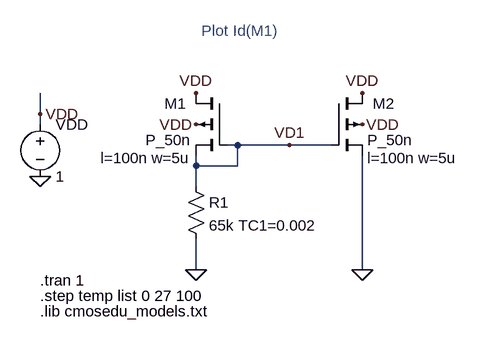
[diagram p0: schematic Fig20_26.asc]
Fig20_26.asc, the LTspice schematic file:
Version 4
SHEET 1 1136 680
WIRE 288 -16 288 -48
WIRE 288 0 288 -16
WIRE 528 64 528 48
WIRE 528 96 528 64
WIRE 528 224 528 176
WIRE 592 32 576 32
WIRE 592 64 528 64
WIRE 592 64 592 32
WIRE 672 32 592 32
WIRE 736 32 672 32
WIRE 784 224 784 48
FLAG 288 80 0
FLAG 288 -16 VDD
FLAG 528 0 VDD
FLAG 784 0 VDD
FLAG 528 -48 VDD
FLAG 784 -48 VDD
FLAG 528 224 0
FLAG 784 224 0
FLAG 672 32 VD1
SYMBOL pmos4 736 -48 R0
WINDOW 0 64 16 Left 0
WINDOW 123 56 100 Left 0
SYMATTR InstName M2
SYMATTR Value2 l=100n w=5u
SYMATTR Value P_50n
SYMBOL pmos4 576 -48 M0
WINDOW 0 63 16 Left 0
WINDOW 123 56 100 Left 0
SYMATTR InstName M1
SYMATTR Value2 l=100n w=5u
SYMATTR Value P_50n
SYMBOL voltage 288 -16 R0
SYMATTR InstName VDD
SYMATTR Value 1
SYMBOL res 512 80 R0
SYMATTR InstName R1
SYMATTR Value 65k TC1=0.002
TEXT 288 288 Left 0 !.lib cmosedu_models.txt
TEXT 536 -144 Left 0 ;Plot Id(M1)
TEXT 288 240 Left 0 !.tran 1
TEXT 288 264 Left 0 !.step temp list 0 27 100

The netlist it stands for:
* Fig20_26.asc
M2 VDD VD1 0 VDD P_50n l=100n w=5u
M1 VDD VD1 VD1 VDD P_50n l=100n w=5u
VDD VDD 0 1
R1 VD1 0 65k TC1=0.002
.model NMOS NMOS
.model PMOS PMOS
.lib standard.mos
.lib cmosedu_models.txt
* Plot Id(M1)
.tran 1
.step temp list 0 27 100
.backanno
.end